# Altium project GSMLift.PrjPcb
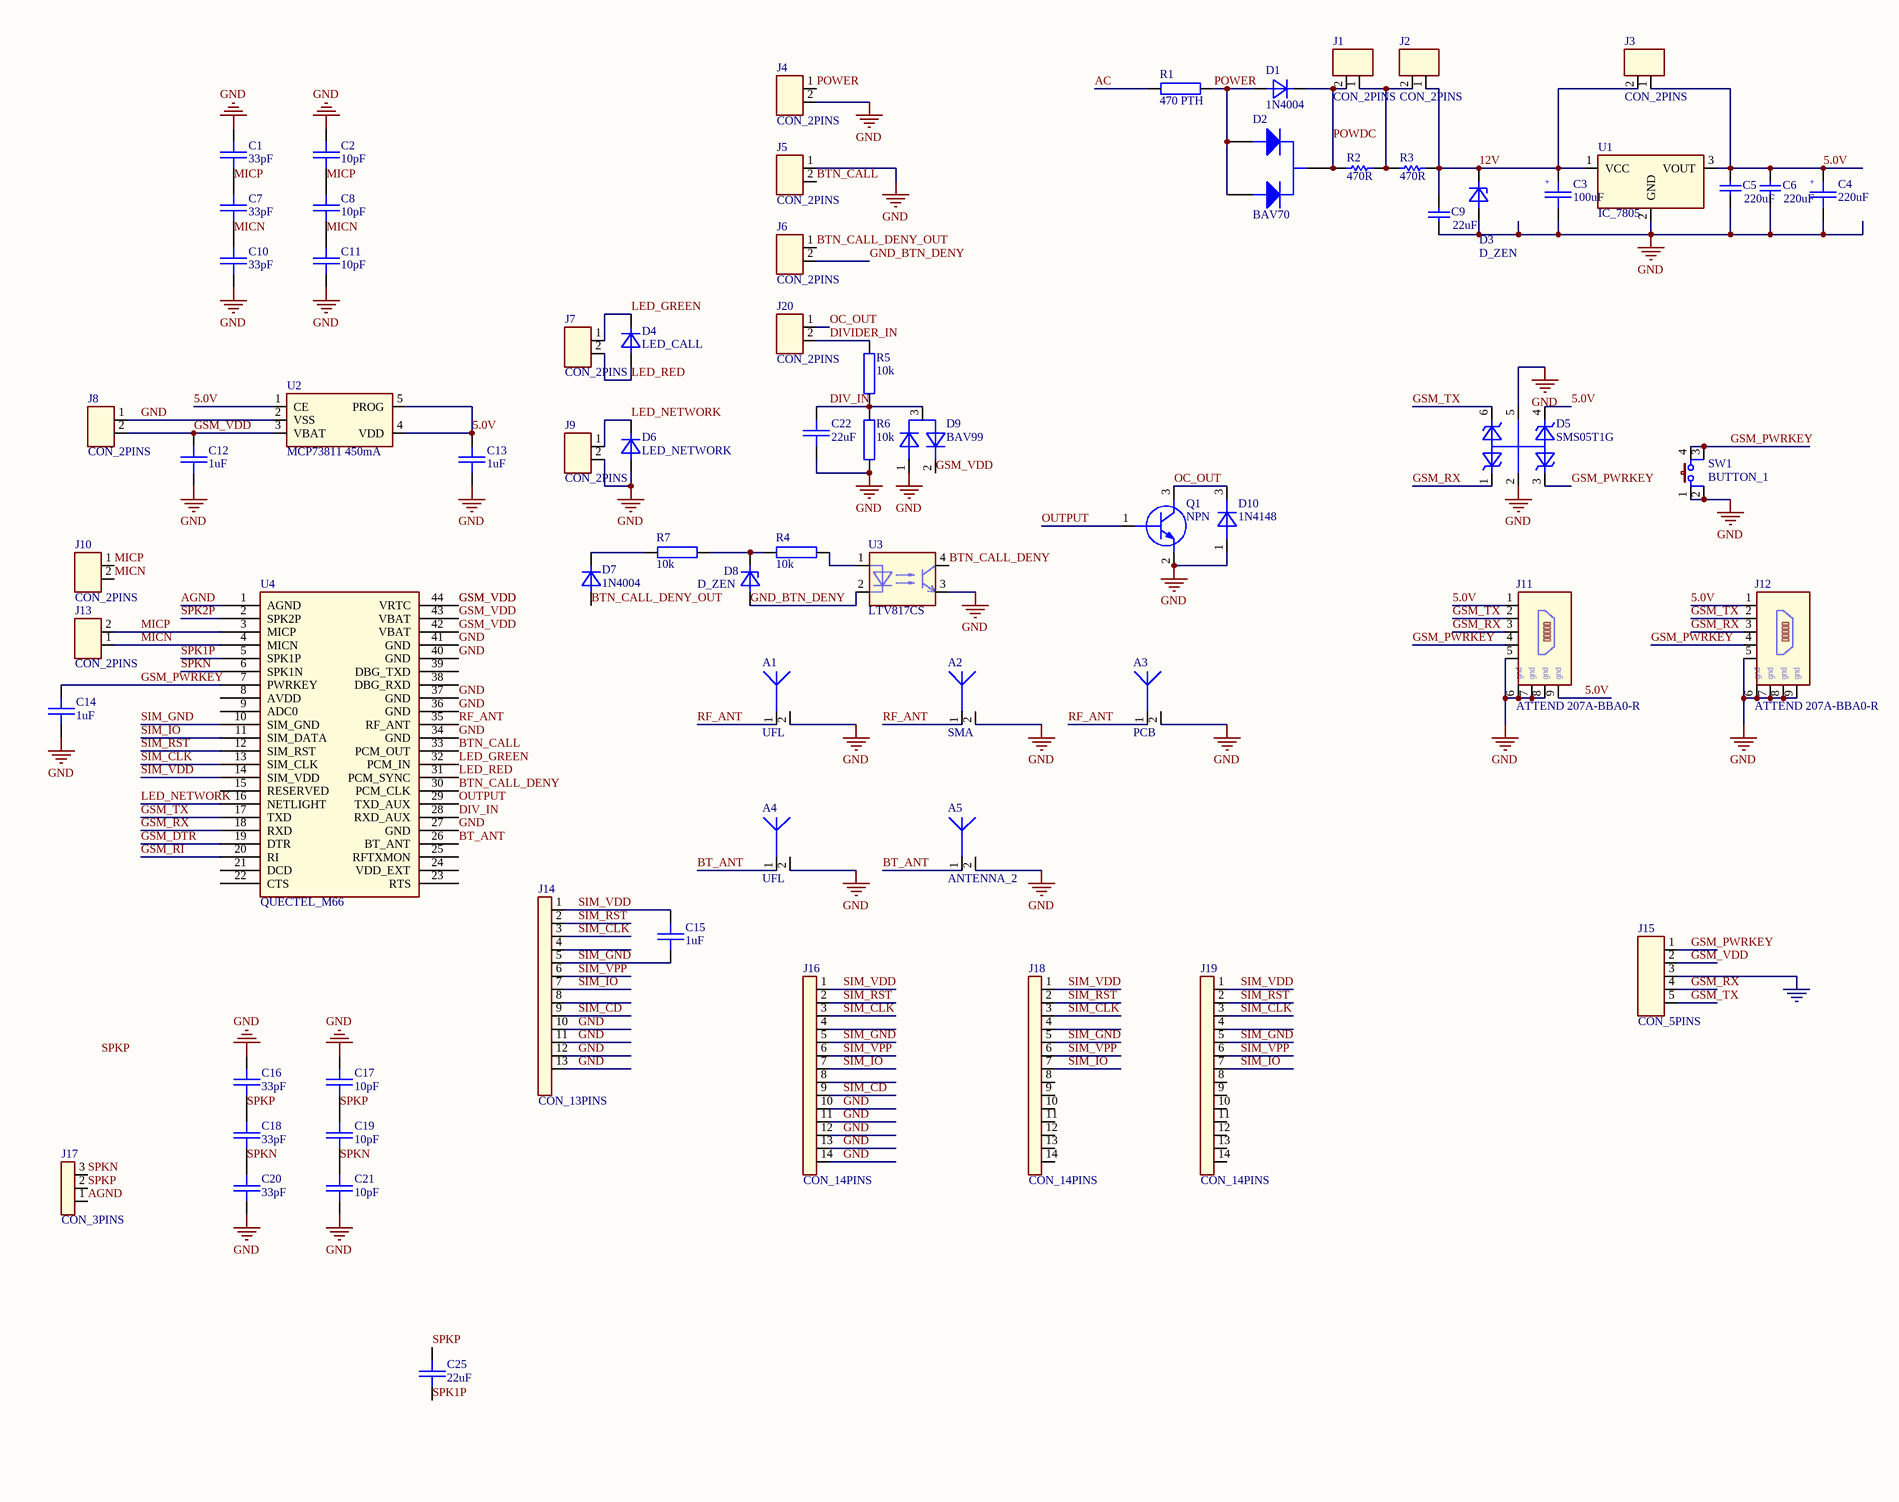
[diagram p0: GSMLift.SchDoc, left]
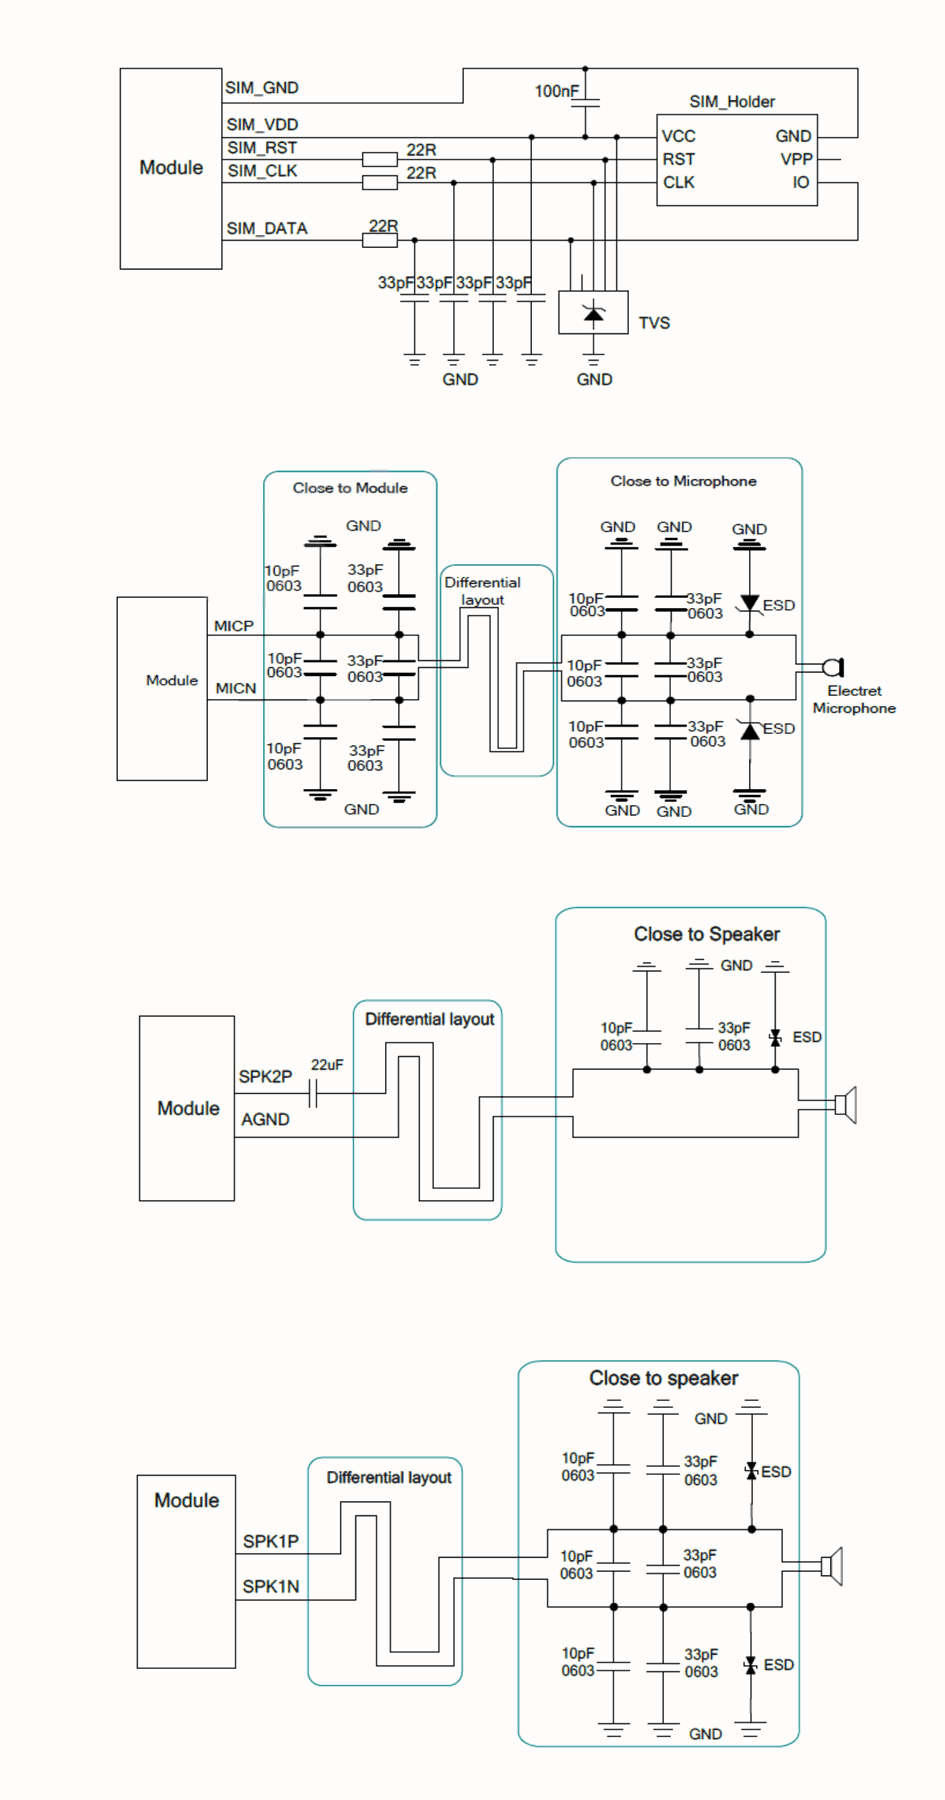
[diagram p1: GSMLift.SchDoc, right]
1 sheet, 71 parts. Net scope: global (net labels, ports and power ports of the same name join across sheets).
Board file: GSMLift.PcbDoc

## Sheet GSMLift.SchDoc
size A2

### Parts
A1  UFL  [SMD_CON_ANTENNA_UFL]
A2  SMA  [SMD_CON_ANTENNA_SMA]
A3  PCB  [SMD_CON_ANTENNA_GSM_PCB_INV]
A4  UFL  [SMD_CON_ANTENNA_UFL]
A5  ANTENNA_2  [SMD_CON_ANTENNA_BT_PCB]
C1  33pF  [SMD_0603_CAPC1608X95N]
C2  10pF  [SMD_0603_CAPC1608X95N]
C3  100uF  [SMD_CAPAE1030X1050N]
C4  220uF  [SMD_CAPAE1030X1050N]
C5  220uF  [SMD_1210_CAPC3225X279N]
C6  220uF  [SMD_1210_CAPC3225X279N]
C7  33pF  [SMD_0603_CAPC1608X95N]
C8  10pF  [SMD_0603_CAPC1608X95N]
C9  22uF  [SMD_1210_CAPC3225X279N]
C10  33pF  [SMD_0603_CAPC1608X95N]
C11  10pF  [SMD_0603_CAPC1608X95N]
C12  1uF  [SMD_0603_CAPC1608X95N]
C13  1uF  [SMD_0603_CAPC1608X95N]
C14  1uF  [SMD_0603_CAPC1608X95N]
C15  1uF  [SMD_0603_CAPC1608X95N]
C16  33pF  [SMD_0603_CAPC1608X95N]
C17  10pF  [SMD_0603_CAPC1608X95N]
C18  33pF  [SMD_0603_CAPC1608X95N]
C19  10pF  [SMD_0603_CAPC1608X95N]
C20  33pF  [SMD_0603_CAPC1608X95N]
C21  10pF  [SMD_0603_CAPC1608X95N]
C22  22uF  [SMD_0805_CAPC2012X95N]
C25  22uF  [SMD_0603_CAPC1608X95N]
D1  1N4004  [SMD_DO214AC_SMA]
D2  BAV70  [SMD_SOT23_SOT95P240X120-3N]
D3  D_ZEN  [SMD_DO214AC_SMA]
D4  LED_CALL  [SMD_0805_LED2012X100N]
D5  SMS05T1G  [SMD_SOT95P280X145-6N-W]
D6  LED_NETWORK  [SMD_0805_LED2012X100N]
D7  1N4004  [SMD_DO214AC_SMA]
D8  D_ZEN  [SMD_DO214AC_SMA]
D9  BAV99  [SMD_SOT23_SOT95P240X120-3N]
D10  1N4148  [SMD_SOT23_SOT95P240X120-3N]
J1  CON_2PINS  [PTH_HDRV02W64P254_1X02]
J2  CON_2PINS  [PTH_HDRV02W64P254_1X02]
J3  CON_2PINS  [PTH_HDRV02W64P254_1X02]
J4  CON_2PINS  [PTH_HDRV02W11060P500_1X02]
J5  CON_2PINS  [PTH_HDRV02W11060P500_1X02]
J6  CON_2PINS  [PTH_HDRV02W11060P500_1X02]
J7  CON_2PINS  [PTH_LED-KINGBRIGHT-L-934SGC]
J8  CON_2PINS  [PTH_HDRV02W64P254_1X02]
J9  CON_2PINS  [PTH_LED-KINGBRIGHT-L-934SGC]
J10  CON_2PINS  [PTH_HDRV02W11060P500_1X02]
J11  ATTEND 207A-BBA0-R  [SMD_CON_MICRO_USB]
J12  ATTEND 207A-BBA0-R  [SMD_CON-CVILUX-CU04-SCM15B0]
J13  CON_2PINS  [PTH_MIC_9.6MM_6MM_2.7MM_PITCH1.9 - duplicate]
J14  CON_13PINS  [SMD_CON-ATTEND_MICRO_SIM_115Q-BCA0]
J15  CON_5PINS  [SIP5 - PGM]
J16  CON_14PINS  [SMD_CON-ATTEND_SIM_115A-BDA0-R01]
J17  CON_3PINS  [PTH_HDRV03W11060P500_1X03]
J18  CON_14PINS  [SMD_CON-ATTEND_SIM_115B-AAA0-R01]
J19  CON_14PINS  [SMD_CON-ATTEND_SIM_115B-AAA0-R01]
J20  CON_2PINS  [PTH_HDRV02W11060P500_1X02]
Q1  NPN  [SMD_SOT23_SOT95P240X120-3N]
R1  470 PTH  [PTH_RESAD2300W78L1750D650P]
R2  470R  [SMD_1206_RESC3216X102N]
R3  470R  [SMD_1206_RESC3216X102N]
R4  10k  [SMD_0603_RESC1608X55N]
R5  10k  [SMD_0603_RESC1608X55N]
R6  10k  [SMD_0805_RESC2012X60N]
R7  10k  [SMD_1206_RESC3216X102N]
SW1  BUTTON_1  [SMD_SW_TACT-64K]
U1  IC_7805  [SMD_TO254P1524X483-3_4N_D2PAK]
U2  MCP73811 450mA  [SMD_SOT26_SOT95P285X140-5N - DLV]
U3  LTV817CS  [SMD_SOIC254P1030X390-4N]
U4  QUECTEL_M66  [SMD_MOD_M66-44N]

### Nets
GND: A1.2 A2.2 A3.2 A4.2 A5.2 C1.1 C2.1 C3.2 C4.2 C5.2 C6.2 C9.2 C10.2 C11.2 C12.2 C13.2 C14.2 C16.1 C17.1 C20.2 C21.2 C22.2 D3.2(A) D5.2(AAAA) D5.5(C4) D6.2(A) D9.1(A) D10.1(A) J4.2 J5.1 J8.1 J9.2 J11.5 J11.6 J11.7 J11.8 J12.5 J12.6 J12.7 J12.8 J12.9 J14.10 J14.11 J14.12 J14.13 J15.3 J16.10 J16.11 J16.12 J16.13 J16.14 Q1.2(E) R6.2 SW1.1 SW1.2 U1.2(GND) U2.2(VSS) U3.3(E) U4.27(GND) U4.34(GND) U4.36(GND) U4.37(GND) U4.40(GND) U4.41(GND)
5.0V: C4.1 C5.1 C6.1 C13.1 D5.4(C3) J3.1 J11.1 J11.9 J12.1 U1.3(VOUT) U2.1(CE) U2.4(VDD) U2.5(PROG)
12V: C3.1 C9.1 D3.1(C) J2.1 J3.2 R3.2 U1.1(VCC)
AC: R1.1
AGND: J17.1 U4.1(AGND)
BT_ANT: A4.1 A5.1 U4.26(BT_ANT)
BTN_CALL: J5.2 U4.33(PCM_OUT)
BTN_CALL_DENY: U3.4(C) U4.30(PCM_CLK)
BTN_CALL_DENY_OUT: D7.2(A) J6.1
DIV_IN: C22.1 D9.3(AC) R5.1 R6.1 U4.28(RXD_AUX)
DIVIDER_IN: J20.2 R5.2
GND_BTN_DENY: D8.2(A) J6.2 U3.2(C)
GSM_DTR: U4.19(DTR)
GSM_PWRKEY: C14.1 D5.3(C2) J11.4 J12.4 J15.1 SW1.3 SW1.4 U4.7(PWRKEY)
GSM_RI: U4.20(RI)
GSM_RX: D5.1(C1) J11.3 J12.3 J15.4 U4.18(RXD)
GSM_TX: D5.6(C4) J11.2 J12.2 J15.5 U4.17(TXD)
GSM_VDD: C12.1 D9.2(C) J8.2 J15.2 U2.3(VBAT) U4.42(VBAT) U4.43(VBAT) U4.44(VRTC)
LED_GREEN: D4.1(C) J7.1 U4.32(PCM_IN)
LED_NETWORK: D6.1(C) J9.1 U4.16(NETLIGHT)
LED_RED: D4.2(A) J7.2 U4.31(PCM_SYNC)
MICN: C7.2 C8.2 C10.1 C11.1 J10.2 J13.1 U4.4(MICN)
MICP: C1.2 C2.2 C7.1 C8.1 J10.1 J13.2 U4.3(MICP)
OC_OUT: D10.3(C) J20.1 Q1.3(C)
OUTPUT: Q1.1(B) U4.29(TXD_AUX)
POWDC: D1.1(C) D2.3(K) J1.2 R2.1
POWER: D1.2(A) D2.1(A1) D2.2(A2) J4.1 R1.2
RF_ANT: A1.1 A2.1 A3.1 U4.35(RF_ANT)
SIM_CD: J14.9 J16.9
SIM_CLK: J14.3 J16.3 J18.3 J19.3 U4.13(SIM_CLK)
SIM_GND: C15.2 J14.5 J16.5 J18.5 J19.5 U4.10(SIM_GND)
SIM_IO: J14.7 J16.7 J18.7 J19.7 U4.11(SIM_DATA)
SIM_RST: J14.2 J16.2 J18.2 J19.2 U4.12(SIM_RST)
SIM_VDD: C15.1 J14.1 J16.1 J18.1 J19.1 U4.14(SIM_VDD)
SIM_VPP: J14.6 J16.6 J18.6 J19.6
SPK1P: C25.2 U4.5(SPK1P)
SPK2P: U4.2(SPK2P)
SPKN: C18.2 C19.2 C20.1 C21.1 J17.3 U4.6(SPK1N)
SPKP: C16.2 C17.2 C18.1 C19.1 C25.1 J17.2
NetD7_1: D7.1(C) R7.1
NetD8_1: D8.1(C) R4.1 R7.2
NetJ1_1: J1.1 J2.2 R2.2 R3.1
NetR4_2: R4.2 U3.1(A)

Not connected (* = marked no-connect by the designer): J14 4 8; J16 4 8; J18 4 8 9 10 11 12 13 14; J19 4 8 9 10 11 12 13 14; U4 8(AVDD) 9(ADC0) 15(RESERVED) 21(DCD) 22(CTS) 23(RTS) 24(VDD_EXT) 25(RFTXMON) 38(DBG_RXD) 39(DBG_TXD)

### Notes on the sheet
- Labels drawn without touching a wire or pin: SPKP
- (in symbol C_POL) +
- (in symbol CON_USB_MINI) gnd

### Library data of the parts
A1-A5 = ANTENNA_2: NOTE: <NOTE>
C1 C2 C7 C8 C10-C22 C25 = C: NOTE: <NOTE>
C3 C4 = C_POL: NOTE: <NOTE>
C5 C6 C9 = Cap Semi: CL32A227MQVNNNE 220UF 6.3V 20% X5R 1210; Published: 8-Jun-2000; LatestRevisionDate: 29-May-2009; LatestRevisionNote: IPC-7351 Footprint Added.; PackageReference: C1206; Publisher: Altium Limited; PackageDescription: Chip Capacitor
  C5 C6: Value: 220uF
  C9: Value: 22uF
D1 D4 D6 D7 = D: NOTE: <NOTE>
D2 = DUAL DIODE BAV70
D3 D8 = D_ZEN: NOTE: <NOTE>
D5 = D_TVS_QUAD_C1AA2AA5C3C4C6: 4 IO lines TVS; NOTE: <NOTE>
D9 = D_DUAL_A1C2AC3: NOTE: <NOTE>
D10 = D_A1C3: NOTE: <NOTE>
J1-J10 J13 J20 = CON_2PINS: NOTE: <NOTE>
J11 J12 = CON_USB_MINI: NOTE: <NOTE>
J15 = CON_5PINS: NOTE: <NOTE>
Q1 = BJT_NPN_B1E2C3: NOTE: <NOTE>
R1 R4-R7 = R: NOTE: <NOTE>; R_BDS: R
R2 R3 = Res1: Resistor; Manufacturer: Generic Components; Class: Passive; Value: 47; Published: 08/06/2000; Publisher: Altium Hobart Technology Centre; SubClass: Resistor
U1 = IC_7805: NOTE: <NOTE>
U2 = IC_MCP73812: MCP73812; DB_PART_NUMBER: PSU000000127; DB_PART_TYPE: Linear Voltage Regulator; DB_MANUFACTURER_PART: ROHM        BD33KA5WF-E2; DB_T_RANGE: -40 to 105; DB_VOLTAGE: 3.3V; DB_CURRENT: 500mA; DB_PACKAGE: SOIC-8; DB_DESCRIPTION: IC BD33KA5WF-E2 SOIC-8; DB_PCB_DEVICE: SMD_SOIC127P620X160-8N; DB_CERTIFIED: ISHIDDEN=T; DB_APPROVED_BY: VSN; DB_APPROVED_ON: 07.5.2014 г. 13:18:28; DB_STATUS: NEW; DB_DATASHEET: http://john.epiqdesign.com/projects/CIS_Datasheets/IC_bdxxka5wf-e-209388.pdf?rev=1408&sc=0
U3 = OPTO_A1C2E3C4: NOTE: <NOTE>
U4 = MOD_QUECTEL_M66

## Assembly variants
Production: not fitted Q1 Q2